# EAGLE design solar-pmic (EAGLE 7.1.0)
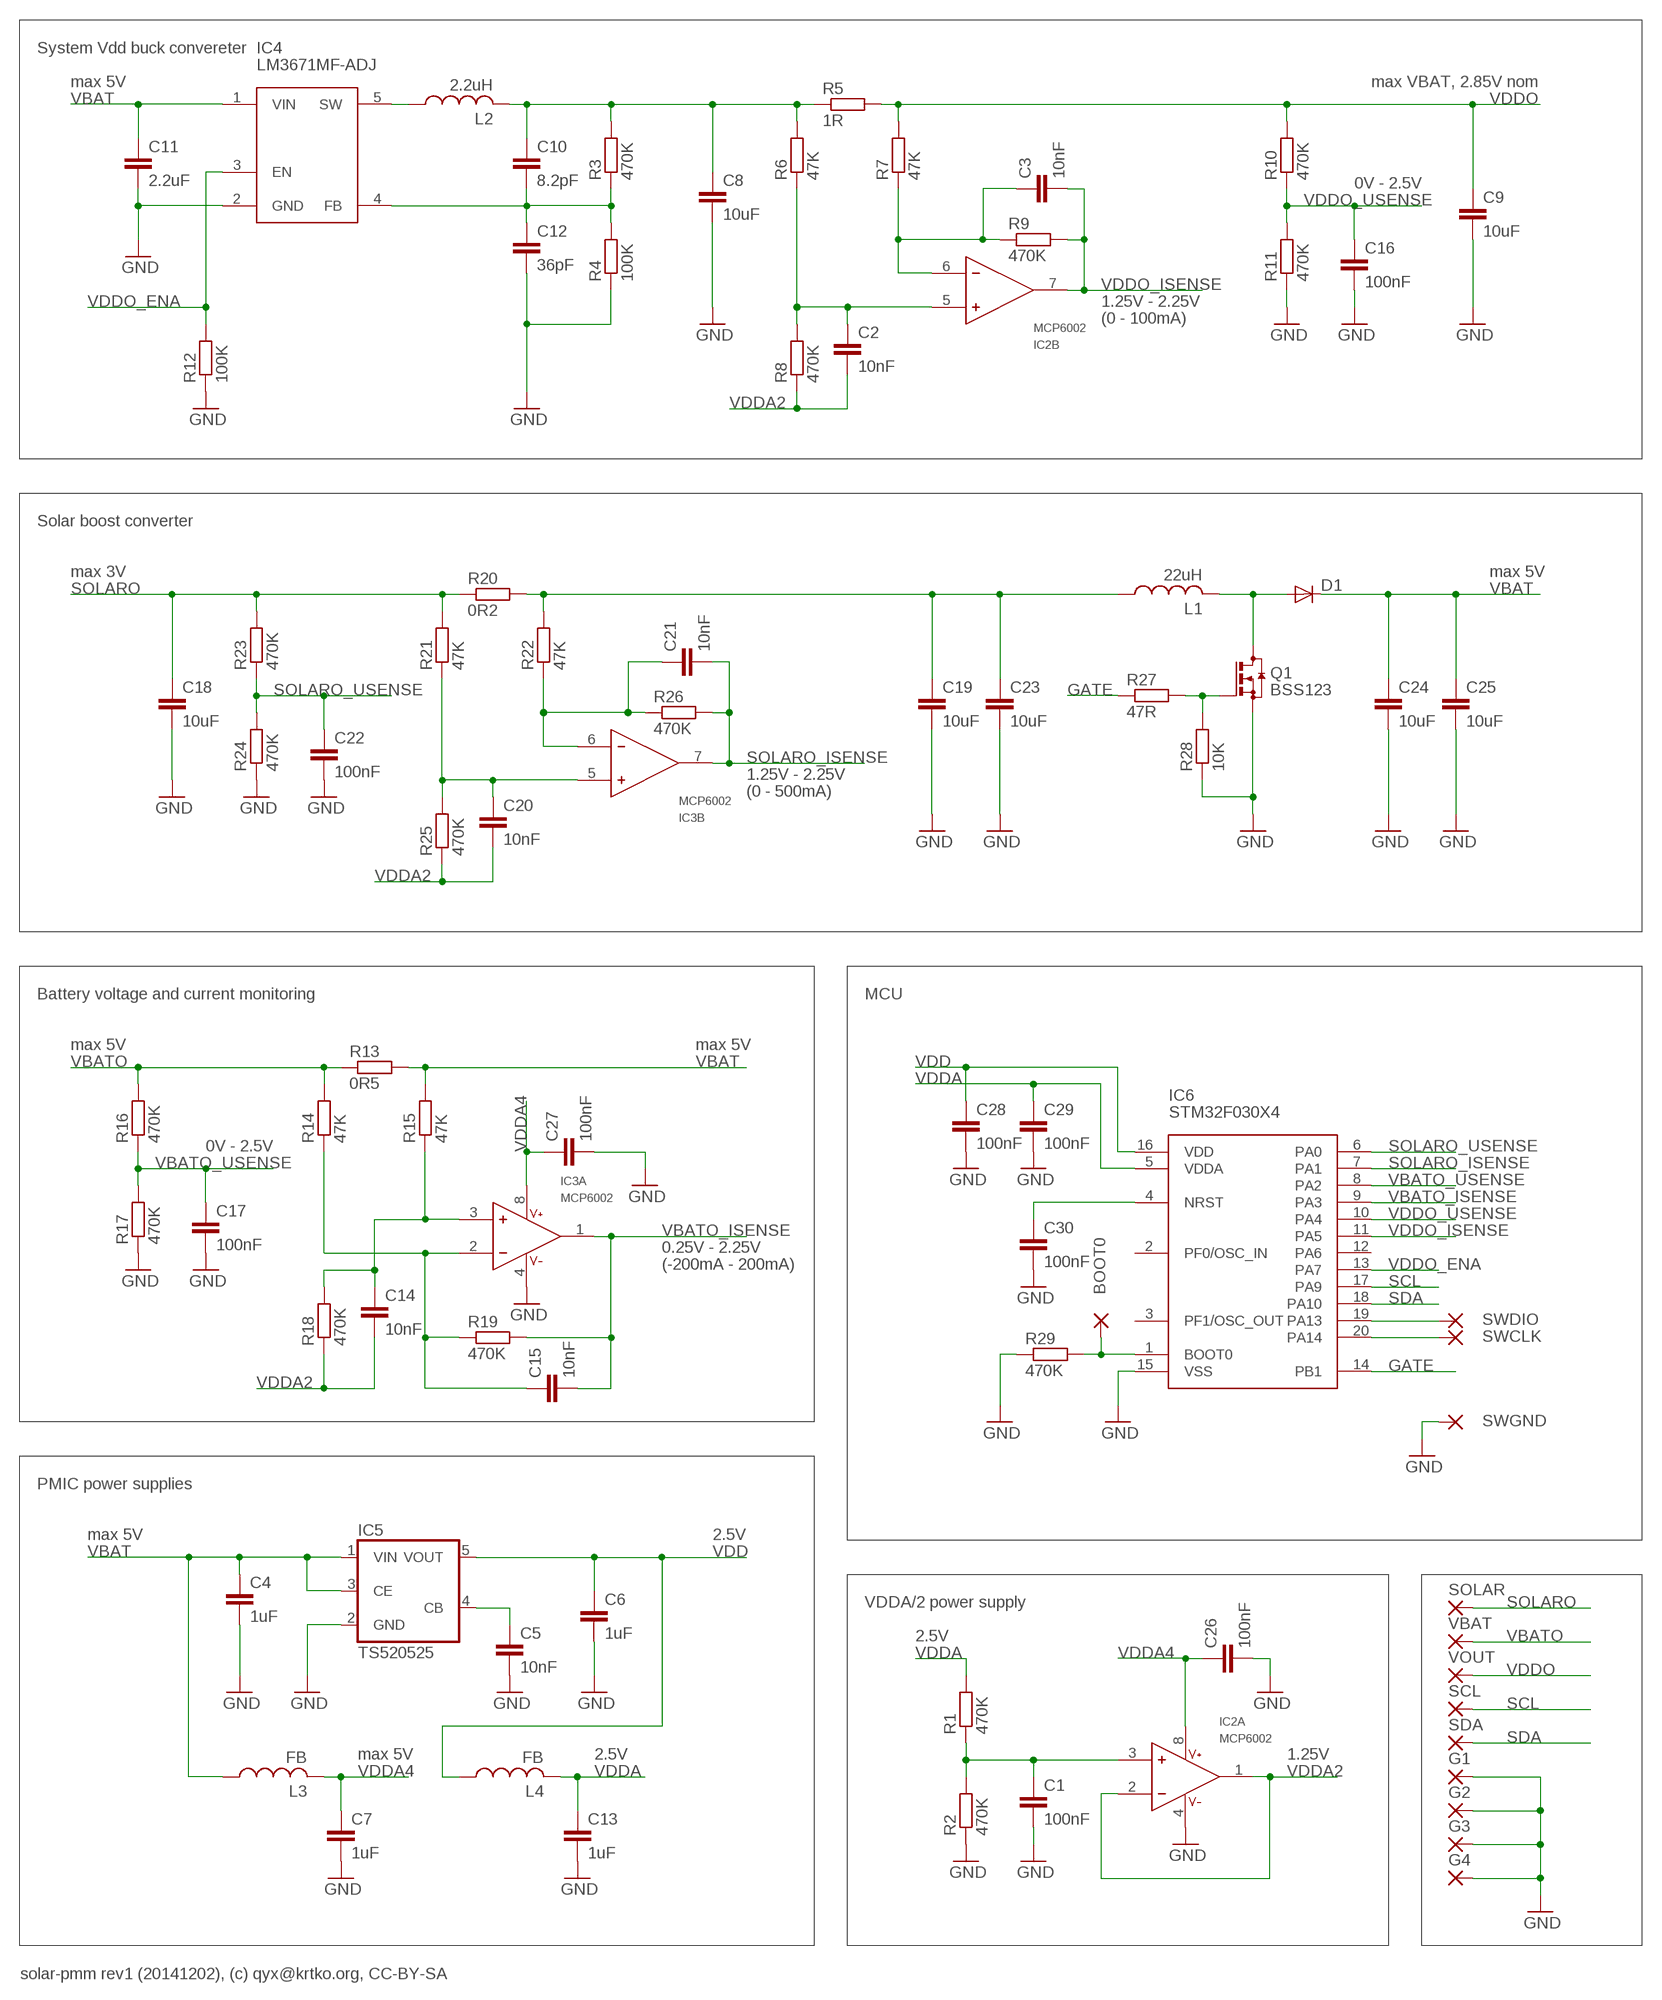
[diagram p0: schematic, sheet 1]

## Parts
BOOT0  SMD2  [SMD1,27-2,54]
C1  100nF  C-EUC0603  [C0603]
C2  10nF  C-EUC0603  [C0603]
C3  10nF  C-EUC0603  [C0603]
C4  1uF  C-EUC0603  [C0603]
C5  10nF  C-EUC0603  [C0603]
C6  1uF  C-EUC0603  [C0603]
C7  1uF  C-EUC0603  [C0603]
C8  10uF  C-EUC0805  [C0805]
C9  10uF  C-EUC0805  [C0805]
C10  8.2pF  C-EUC0603  [C0603]
C11  2.2uF  C-EUC0805  [C0805]
C12  36pF  C-EUC0603  [C0603]
C13  1uF  C-EUC0603  [C0603]
C14  10nF  C-EUC0603  [C0603]
C15  10nF  C-EUC0603  [C0603]
C16  100nF  C-EUC0603  [C0603]
C17  100nF  C-EUC0603  [C0603]
C18  10uF  C-EUC0805  [C0805]
C19  10uF  C-EUC0805  [C0805]
C20  10nF  C-EUC0603  [C0603]
C21  10nF  C-EUC0603  [C0603]
C22  100nF  C-EUC0603  [C0603]
C23  10uF  C-EUC0805  [C0805]
C24  10uF  C-EUC0805  [C0805]
C25  10uF  C-EUC0805  [C0805]
C26  100nF  C-EUC0603  [C0603]
C27  100nF  C-EUC0603  [C0603]
C28  100nF  C-EUC0603  [C0603]
C29  100nF  C-EUC0603  [C0603]
C30  100nF  C-EUC0603  [C0603]
D1  DIODE-MINIMELF  [MINIMELF]
G1  2,15/1,0  [2,15/1,0]
G2  2,15/1,0  [2,15/1,0]
G3  2,15/1,0  [2,15/1,0]
G4  2,15/1,0  [2,15/1,0]
IC2  MCP6002  LT6237CMS8  [MSOP8]
IC3  MCP6002  LT6237CMS8  [MSOP8]
IC4  LM3671MF-ADJ  LM3671MF  [SOT23-5]
IC5  TS520525  [SOT25]
IC6  STM32F030X4  [TSSOP20_SO]
L1  22uH  L-USL3225M  [L3225M]
L2  2.2uH  L-USL3225M  [L3225M]
L3  FB  L-USL2012C  [L2012C]
L4  FB  L-USL2012C  [L2012C]
Q1  BSS123  [SOT23]
R1  470K  R-EU_R0603  [R0603]
R2  470K  R-EU_R0603  [R0603]
R3  470K  R-EU_R0603  [R0603]
R4  100K  R-EU_R0603  [R0603]
R5  1R  R-EU_R0805  [R0805]
R6  47K  R-EU_R0603  [R0603]
R7  47K  R-EU_R0603  [R0603]
R8  470K  R-EU_R0603  [R0603]
R9  470K  R-EU_R0603  [R0603]
R10  470K  R-EU_R0603  [R0603]
R11  470K  R-EU_R0603  [R0603]
R12  100K  R-EU_R0603  [R0603]
R13  0R5  R-EU_R0805  [R0805]
R14  47K  R-EU_R0603  [R0603]
R15  47K  R-EU_R0603  [R0603]
R16  470K  R-EU_R0603  [R0603]
R17  470K  R-EU_R0603  [R0603]
R18  470K  R-EU_R0603  [R0603]
R19  470K  R-EU_R0603  [R0603]
R20  0R2  R-EU_R0805  [R0805]
R21  47K  R-EU_R0603  [R0603]
R22  47K  R-EU_R0603  [R0603]
R23  470K  R-EU_R0603  [R0603]
R24  470K  R-EU_R0603  [R0603]
R25  470K  R-EU_R0603  [R0603]
R26  470K  R-EU_R0603  [R0603]
R27  47R  R-EU_R0603  [R0603]
R28  10K  R-EU_R0603  [R0603]
R29  470K  R-EU_R0603  [R0603]
SCL  2,15/1,0  [2,15/1,0]
SDA  2,15/1,0  [2,15/1,0]
SOLAR  2,15/1,0  [2,15/1,0]
SWCLK  SMD2  [SMD1,27-2,54]
SWDIO  SMD2  [SMD1,27-2,54]
SWGND  SMD2  [SMD1,27-2,54]
VBAT  2,15/1,0  [2,15/1,0]
VOUT  2,15/1,0  [2,15/1,0]

## Nets
GATE: IC6.14(PB1) R27.1
GND: C1.2 C4.2 C5.2 C6.2 C7.2 C8.2 C9.2 C11.2 C12.2 C13.2 C16.2 C17.2 C18.2 C19.2 C22.2 C23.2 C24.2 C25.2 C26.2 C27.2 C28.2 C29.2 C30.2 G1.1(P) G2.1(P) G3.1(P) G4.1(P) IC2.4(A:V-) IC3.4(A:V-) IC4.2(GND) IC5.2(GND) IC6.15(VSS) Q1.2(S) R2.1 R4.1 R11.1 R12.1 R17.1 R24.1 R28.1 R29.1 SWGND.1(P)
N$1: C1.1 IC2.3(A:IN+) R1.1 R2.2
N$2: C8.1 C10.1 L2.2 R3.2 R5.1 R6.2
N$3: IC4.5(SW) L2.1
N$4: Q1.1(G) R27.2 R28.2
N$5: C3.1 IC2.6(B:IN-) R7.1 R9.1
N$6: C2.1 IC2.5(B:IN+) R6.1 R8.2
N$7: C10.2 C12.1 IC4.4(FB) R3.1 R4.2
N$8: C21.1 IC3.6(B:IN-) R22.1 R26.1
N$9: C5.1 IC5.4(CB)
N$10: C20.1 IC3.5(B:IN+) R21.1 R25.2
N$11: C15.1 IC3.2(A:IN-) R14.1 R19.1
N$12: C19.1 C23.1 L1.1 R20.2 R22.2
N$13: D1.A L1.2 Q1.3(D)
N$14: C14.1 IC3.3(A:IN+) R15.1 R18.2
N$15: BOOT0.1(P) IC6.1(BOOT0) R29.2
N$16: IC6.19(PA13) SWDIO.1(P)
N$17: IC6.20(PA14) SWCLK.1(P)
N$18: C30.1 IC6.4(NRST)
SCL: IC6.17(PA9) SCL.1(P)
SDA: IC6.18(PA10) SDA.1(P)
SOLARO: C18.1 R20.1 R21.2 R23.2 SOLAR.1(P)
SOLARO_ISENSE: C21.2 IC3.7(B:OUT) IC6.7(PA1) R26.2
SOLARO_USENSE: C22.1 IC6.6(PA0) R23.1 R24.2
VBAT: C4.1 C11.1 C24.1 C25.1 D1.C IC4.1(VIN) IC5.1(VIN) IC5.3(CE) L3.1 R13.2 R15.2
VBATO: R13.1 R14.2 R16.2 VBAT.1(P)
VBATO_ISENSE: C15.2 IC3.1(A:OUT) IC6.9(PA3) R19.2
VBATO_USENSE: C17.1 IC6.8(PA2) R16.1 R17.2
VDD: C6.1 C28.1 IC5.5(VOUT) IC6.16(VDD) L4.1
VDDA: C13.1 C29.1 IC6.5(VDDA) L4.2 R1.2
VDDA2: C2.2 C14.2 C20.2 IC2.1(A:OUT) IC2.2(A:IN-) R8.1 R18.1 R25.1
VDDA4: C7.1 C26.1 C27.1 IC2.8(A:V+) IC3.8(A:V+) L3.2
VDDO: C9.1 R5.2 R7.2 R10.2 VOUT.1(P)
VDDO_ENA: IC4.3(EN) IC6.13(PA7) R12.2
VDDO_ISENSE: C3.2 IC2.7(B:OUT) IC6.11(PA5) R9.2
VDDO_USENSE: C16.1 IC6.10(PA4) R10.1 R11.2
Unconnected: IC6.2(PF0/OSC_IN) IC6.3(PF1/OSC_OUT) IC6.12(PA6)

## Notes on the sheet
- System Vdd buck convereter
- max 5V | max VBAT, 2.85V nom
- 0V - 2.5V
- 1.25V - 2.25V
- (0 - 100mA)
- Solar boost converter
- max 3V | max 5V
- 1.25V - 2.25V
- (0 - 500mA)
- Battery voltage and current monitoring | MCU
- max 5V | max 5V
- 0V - 2.5V
- 0.25V - 2.25V
- (-200mA - 200mA)
- PMIC power supplies
- max 5V | 2.5V
- VDDA/2 power supply
- 2.5V
- max 5V | 2.5V | 1.25V
- solar-pmm rev1 (20141202), (c) qyx@krtko.org, CC-BY-SA

## Library data of the parts
BOOT0 SWCLK SWDIO SWGND = wirepad:SMD2: SMD PAD
C1-C30 = rcl:C-EU: CAPACITOR, European symbol
D1 = diode:DIODE-: DIODE
G1-G4 SCL SDA SOLAR VBAT VOUT = wirepad:2,15/1,0: THROUGH-HOLE PAD
IC2 IC3 = qyx-misc:LT6237
IC4 = qyx-misc:LM3671
IC5 = v-reg:TS5205: 150mA Low Noise LDO Voltage Regulator with Enable TSC [Taiwan Semiconductor Company, Ltd] Source: http://www.taiwansemi.com .. 5205_0409c.pdf
IC6 = qyx-misc:STM32F030X4
L1-L4 = rcl:L-US: INDUCTOR, American symbol
Q1 = transistor-small-signal:BSS123: N-CHANNEL MOS FET
R1-R29 = rcl:R-EU_: RESISTOR, European symbol

## Board
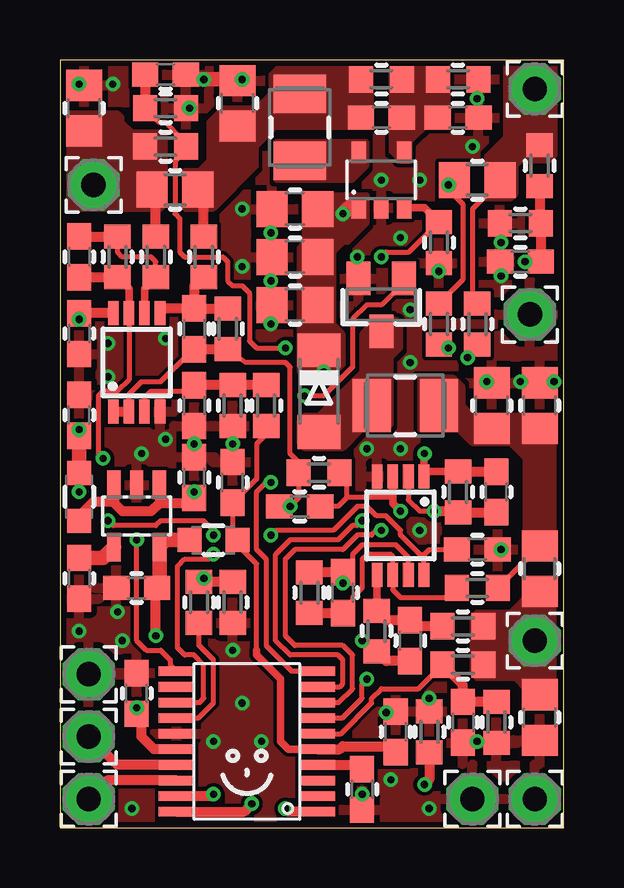
[diagram p1: board, top side]
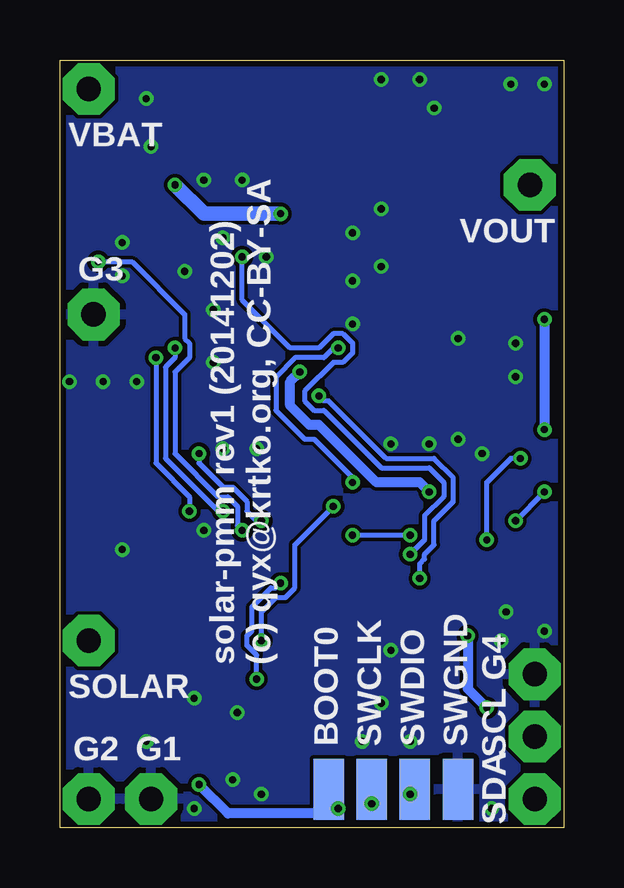
[diagram p2: board, bottom side, seen from below]

Size 21 x 32 mm. Coordinates in mm from the lower left corner, seen from the top.
Outline: 0,0 21,0 21,32 0,32 0,0
Copper layers (1*16): Top 0.035mm / dielectric 1.5mm / Bottom 0.035mm
Design rules "seeed": minimum track width 6mil, minimum drill 0.3mm, track to track 6mil, track to pad 6mil, pad to pad 6mil, via to via 6mil, smd to smd 0mil, copper to edge 10mil, drill to drill 10mil, minimum pad ring 6mil, minimum via ring 6mil, stop-mask expansion 2mil, vias tented up to drill 0.5mm, thermal gap 10mil

### Footprints (pad centres in the part's own frame; a part is rotated, then mirrored left to right if it is on the bottom)
SMD1,27-2,54 = smd 1.27 x 2.54: 1 0,0
C0603 = smd 1.1 x 1: 1 -0.85,0; 2 0.85,0
C0805 = smd 1.3 x 1.5: 1 -0.95,0; 2 0.95,0
MINIMELF = smd 1.4 x 1.8: A 1.7,0; C -1.7,0
2,15/1,0 = drill 1.016 pad 2.159 octagon: 1 0,0
MSOP8 = smd 0.45 x 1: 1 -0.975,-2.05; 2 -0.325,-2.05; 3 0.325,-2.05; 4 0.975,-2.05; 5 0.975,2.05; 6 0.325,2.05; 7 -0.325,2.05; 8 -0.975,2.05
SOT23-5 = smd 0.6 x 0.9: 1 -0.95,-1.15; 2 0,-1.15; 3 0.95,-1.15; 4 0.95,1.15; 5 -0.95,1.15
SOT25 = smd 0.55 x 1.2: 1 -0.95,-1.3; 2 0,-1.3; 3 0.95,-1.3; 4 0.95,1.3; 5 -0.95,1.3
TSSOP20_SO = smd 0.4 x 1.5: 1 -2.925,-2.925; 2 -2.275,-2.925; 3 -1.625,-2.925; 4 -0.975,-2.925; 5 -0.325,-2.925; 6 0.325,-2.925; 7 0.975,-2.925; 8 1.625,-2.925; 9 2.275,-2.925; 10 2.925,-2.925; 11 2.925,2.925; 12 2.275,2.925; 13 1.625,2.925; 14 0.975,2.925; 15 0.325,2.925; 16 -0.325,2.925; 17 -0.975,2.925; 18 -1.625,2.925; 19 -2.275,2.925; 20 -2.925,2.925
L3225M = smd 1.6 x 2.2: 1 -1.4,0; 2 1.4,0
L2012C = smd 1 x 1: 1 -1,0; 2 1,0
SOT23 = smd 1 x 1.4: 1 -0.95,-1.1; 2 0.95,-1.1; 3 0,1.1
R0603 = smd 1 x 1.1: 1 -0.85,0; 2 0.85,0
R0805 = smd 1.3 x 1.5: 1 -0.95,0; 2 0.95,0

### Placement (x,y rotation side)
BOOT0  9.8,1.6 0 bottom
C1  5.6,17.6 270 top
C2  5.6,20.8 270 top
C3  0.8,23.8 270 top
C4  5.6,14.6 90 top
C5  0.8,10.4 270 top
C6  3.2,10 180 top
C7  0.8,17.2 90 top
C8  7.4,30.2 90 top
C9  1,30 90 top
C10  13.4,29.6 0 top
C11  9.8,25.8 180 top
C12  16.6,29.6 0 top
C13  7.2,14.4 90 top
C14  10,13.4 180 top
C15  18.2,14 90 top
C16  4.4,31.4 0 top
C17  19.2,23.6 180 top
C18  20,4.6 270 top
C19  20,17.6 90 top
C20  14.6,7.8 270 top
C21  11.8,9.8 90 top
C22  16.8,4.4 270 top
C23  18,17.6 90 top
C24  9.8,21.8 180 top
C25  9.8,23.8 180 top
C26  0.8,20.6 270 top
C27  17.4,11.6 0 top
C28  3.2,5.6 90 top
C29  14,4 90 top
C30  12.6,1.6 270 top
D1  10.8,18.2 270 top
G1  17.2,1.2 0 top
G2  19.8,1.2 0 top
G3  19.6,21.4 0 top
G4  1.2,6.4 0 top
IC2  3.2,19.4 0 top
IC3  14.2,12.6 180 top
IC4  13.4,27 0 top
IC5  3.2,13 180 top
IC6  7.8,3.6 90 top
L1  14.4,17.6 180 top
L2  10,29.2 90 top
L3  0.8,13.8 90 top
L4  6.4,12 0 top
Q1  13.4,21.8 180 top
R1  8.6,17.6 270 top
R2  7.2,17.6 90 top
R3  13.4,31.2 180 top
R4  16.6,31.2 180 top
R5  4.8,26.6 180 top
R6  6,23.8 90 top
R7  4,23.8 90 top
R8  7,20.8 90 top
R9  2.4,23.8 270 top
R10  4.4,28.4 180 top
R11  4.4,30 180 top
R12  15.8,24.4 90 top
R13  17.4,27 180 top
R14  17.4,21 90 top
R15  15.8,21 90 top
R16  20,27.6 90 top
R17  19.2,25.2 0 top
R18  10.8,14.8 0 top
R19  16.6,14 90 top
R20  20,10.8 90 top
R21  16.8,8.4 0 top
R22  17.4,10 0 top
R23  16.8,6.8 0 top
R24  18.2,4.4 90 top
R25  13.2,8.2 90 top
R26  10.4,9.8 90 top
R27  5.8,9.4 90 top
R28  7.2,9.4 90 top
R29  15.4,4 270 top
SCL  1.2,3.8 0 top
SDA  1.2,1.2 0 top
SOLAR  19.8,7.8 0 top
SWCLK  8,1.6 0 bottom
SWDIO  6.2,1.6 0 bottom
SWGND  4.4,1.6 0 bottom
VBAT  19.8,30.8 0 top
VOUT  1.4,26.8 0 top

### Tracks (layer width: path | path; a pad name or v marks a point on that pad's centre or on a via)
GATE
  Top 0.2: IC6.14 5.78,4.58 6.4,5.2 6.4,7 5.8,7.6 R27.1
GND  (via drill 0.3)
  Top 0.406: v17.4,3.6 16.85,3.6 C22.2 | v18.4,23 18.4,23.55 C17.2
  Top 0.61: 7.4,31.2 v6,31.2 5.4,31.2 5.2,31.4
  other vias: 7.6,5.2 7.6,25.8 7.6,23.4 8.8,24.8 13.4,27 12.4,23.8 15,27 2,20.2 4.4,16.2 7.2,16 3.4,15.6 5.6,16 17.4,30.4 17.2,28.4 14.2,24.6 15.8,23.2 14.6,21.6 7.6,31.2 5.4,30 2.2,31 0.8,31 18.4,24.4 17.8,18.6 19.2,18.6 20.6,18.6 18.4,11.6 8.8,22.8 8.8,21 15,12.4 12.8,15.8 12.6,1.4 3,0.8 6.4,3.6 13.6,4.8 15.4,5.4 8.4,3.6 7.2,7.4 0.8,8.2 2.6,7.8 2.4,9 4.4,20.4 2,18.8 14.2,15.8 14.6,19.4 13.8,2 15.4,0.8
  pour Bottom (rank 2): 0.2,0.2 20.8,0.2 20.8,31.8 0.2,31.8
  pour Top (rank 2): 0.2,0.2 20.8,0.2 20.8,31.8 0.2,31.8
N$1
  Top 0.2: IC2.3 3.53,17.93 3.8,18.2 5.35,18.2 C1.1
  Top 0.406: R1.1 R2.2 C1.1
N$2
  Top 0.406: R6.2 6,26.35 R5.1
  pour Top (no thermals): 9,29.2 13,29.2 13,31.8 9.2,31.8 8.8,31.4 8.8,30.6 8.2,30 6.8,30 6.2,29.4 6.2,27.8 5.8,27.4 5.2,27.4 5.2,25.8 6.4,25.8 8.2,27.6 8.2,28.4
N$3
  pour Top (no thermals): 9,27 12.2,27 12.8,27.6 12.8,28.6 9,28.6
N$4  (via drill 0.3)
  Top 0.2: Q1.1 14.35,22.75 13.4,21.8 12.8,21.8 12.2,21.2 12.2,19.2 11,18 v10.2,18
  Top 0.406: R28.2 R27.2 v6,10.4
  Bottom 0.2: v10.2,18 10,17.8 9.8,17.8 7.4,15.4 5.4,15.4 4.6,14.6 4.6,13.6 5.4,12.8 5.4,11.8 5.8,11.4 5.8,11.2 6,11 v6,10.4
N$5
  Top 0.2: R7.1 4,23.6 3.8,23.8 2.6,23.8 2.4,24 R9.1
  Top 0.305: IC2.6 3.53,22.48 R7.1
  Top 0.406: C3.1 R9.1
N$6
  Top 0.406: C2.1 4.37,21.65 IC2.5 | C2.1 R8.2 | R6.1 5.95,22.95 5.6,22.6 C2.1
N$7
  pour Top (no thermals): 14.2,27.8 14.6,27.8 14.6,28.6 15.4,29.4 16.2,29.4 16.2,31.8 13.8,31.8 13.8,28.2
N$8
  Top 0.2: R22.1 16.15,9.6 14.2,9.6 13.87,9.93 IC3.6 13.87,11.32 13.8,11.4 12.8,11.4 12.6,11.2 12.6,10 12.2,9.6 12.2,9.35 C21.1
  Top 0.406: R26.1 C21.1
N$9
  Top 0.61: C5.1 1.8,11.25 IC5.4
N$10
  Top 0.2: 13.22,9.27 R25.2
  Top 0.305: IC3.5 13.22,9.27
  Top 0.406: R25.2 13.6,8.65 C20.1 14.85,8.4 R21.1
N$11  (via drill 0.3)
  Top 0.2: IC3.2 14.53,13.68 15,13.2 v15.6,13.2 | R14.1 17.4,20 v17,19.6
  Top 0.406: v15.6,13.2 16.55,13.2 R19.1 C15.1
  Bottom 0.2: v17,19.6 17,15.2 15.6,13.8 v15.6,13.2
N$12
  Top 0.2: R20.2 R22.2
  pour Top (no thermals): 15,18.8 16.4,18.8 16.8,18.4 16.8,17.6 17.2,17.2 20.6,17.2 20.6,11.2 19.4,11.2 19.4,15.4 18.8,16 17.2,16 16.6,16.6 15,16.6
N$13
  pour Top (no thermals): 13.2,21.2 14,21.2 14.2,21 14.2,20 13.8,19.6 13.8,16.8 13.6,16.6 12.6,16.6 11.8,15.8 10.2,15.8 10,16 10,17 10.2,17.2 10.8,17.2 12.6,19 12.6,20.6
N$14  (via drill 0.3)
  Top 0.2: R15.1 16.05,20.15 v16.2,20 | 13.87,13.78 11.98,13.78 | 11.98,13.78 11.6,13.4 C14.1 | 11.98,13.78 11.98,14.47 R18.2
  Top 0.305: IC3.3 13.87,13.78 13.87,13.53 v14.2,13.2
  Bottom 0.2: v16.2,20 16.2,19.6 16.6,19.2 16.6,15.4 14.4,13.2 v14.2,13.2
N$15  (via drill 0.3)
  Top 0.406: R29.2 15.4,2 v15.2,1.8 | IC6.1 9.53,0.67 v9.4,0.8
  Bottom 0.406: BOOT0.1 9.8,1.2 v9.4,0.8 9.6,0.6 14,0.6 v15.2,1.8
N$16  (via drill 0.3)
  Top 0.406: IC6.19 6.33,1.33 v6.4,1.4
  Bottom 0.406: v6.4,1.4 SWDIO.1
N$17  (via drill 0.3)
  Top 0.406: IC6.20 7.67,0.67 v8,1
  Bottom 0.406: v8,1 SWCLK.1
N$18
  Top 0.2: 12.22,2.62 C30.1
  Top 0.406: IC6.4 12.22,2.62
SCL
  Top 0.406: IC6.17 2.38,2.62 SCL.1
SDA
  Top 0.406: IC6.18 1.97,1.97 SDA.1
SOLARO
  pour Top (no thermals): 19.4,10.4 20.6,10.4 20.6,5 19.4,5 19.4,5.8 19,6.2 17.4,6.2 17.2,6.4 17.2,8.8 17.4,9 18.8,9 19.4,9.6
SOLARO_ISENSE  (via drill 0.3)
  Top 0.2: IC3.7 14.53,11.28 14,11.8 12.6,11.8 12.2,11.4 12.2,11.05 C21.2 v11.8,10.2 | v12.8,6.2 12.6,6 12.6,5.4 11.78,4.58 IC6.7
  Top 0.406: C21.2 R26.2
  Bottom 0.2: v12.8,6.2 12.8,7.2 13.2,7.6 13.2,8 13,8.2 13,9.2 12.2,10 12,10 v11.8,10.2
SOLARO_USENSE
  Top 0.2: R23.1 14.95,5.8 13.4,5.8 13,5.4 13,5.2 11.72,3.92 IC6.6
  Top 0.406: R23.1 16.8,5.95 C22.1 R24.2
VBAT  (via drill 0.3)
  Top 0.2: R13.2 16.45,26.35 16.8,26 16.8,22.85 R15.2
  Top 0.406: IC5.1 4.15,13.55 | 4.15,13.55 3.8,13.2 2.6,13.2 2.25,13.55 | IC5.3 2.25,13.55 | L3.1 0.8,13 1.4,13.6 2.2,13.6 2.25,13.55 | 4.15,13.55 5.4,13.55 C4.1
  Top 0.61: IC4.1 12.05,25.85 v11.8,25.6 | v16.2,26.8 16.25,26.8 R13.2 | C4.1 v5.6,14
  Bottom 0.406: v5.6,14 6,14.4 7.8,14.4 10.2,16.8 10.6,16.8 11.4,17.6 11.4,18.6 v11,19
  Bottom 0.61: v11.8,25.6 15,25.6 v16.2,26.8
  pour Top (no thermals): 10.2,26.4 12.8,26.4 12.8,25.2 12,24.4 11.8,24.4 11.4,24 11.4,21 11.8,20.6 11.8,19 11.4,18.6 10.4,18.6 10,19 10,24.2 10.2,24.4 10.4,24.4 10.2,24.6
VBATO
  Top 0.2: R13.1 18.35,26.95 17.2,25.8 17.2,22.05 R14.2
  pour Top (no thermals): 18.6,31.8 20.8,31.8 20.8,28.2 20.4,27.8 19.2,27.8 19,27.6 19,26.4 18.8,26.2 17.8,26.2 17.8,28 18.6,28.8
VBATO_ISENSE  (via drill 0.3)
  Top 0.2: IC6.9 11.67,5.87 11.8,6 11.8,7 11.6,7.2 9.6,7.2 9,7.8 9,11.4 9.6,12 11.6,12 12.2,12.6 12.4,12.6 v12.6,12.8
  Top 0.305: v15.2,15.6 15.17,15.57 IC3.1 15.37,14.85 R19.2
  Top 0.406: R19.2 C15.2
  Bottom 0.2: v15.2,15.6 15.2,15.2 14.2,14.2 13.8,14.2 13.2,13.6 13.2,13.2 12.8,12.8 v12.6,12.8
VBATO_USENSE  (via drill 0.3)
  Top 0.2: C17.1 v19.4,23.6 | IC6.8 11.62,5.23 12.2,5.8 12.2,7.2 11.8,7.6 9.8,7.6 9.4,8 9.4,11.2 9.8,11.6 11.8,11.6 12.4,12.2 13,12.2 13.2,12.4 v13.4,12.4
  Top 0.406: R16.1 20,25.25 | R17.2 C17.1
  Top 0.61: 20,25.25 R17.2
  Bottom 0.2: v19.4,23.6 18,23.6 15.8,21.4 15.8,20.4 15.6,20.2 15.6,19.6 16.2,19 16.2,15.6 14.4,13.8 14,13.8 13.6,13.4 13.6,12.6 v13.4,12.4
VDD  (via drill 0.3)
  Top 0.406: IC6.16 3.92,3.27 3.4,3.8 3.4,4.55 C28.1 v3.2,5 | v4,8 4,9.95 C6.1
  Top 0.61: C6.1 4.15,10.1 IC5.5 4.15,11.75 4.4,12 L4.1
  Bottom 0.406: v4,8 4,5.8 v3.2,5
VDDA
  Top 0.2: R1.2 8.8,16.6 8.2,16 8.2,14.55 C13.1 7.2,12.2 L4.2 7.4,11.8 8.2,11 8.2,7.4 | 13.55,3.4 C29.1
  Top 0.305: IC6.5 9.53,3.27 9.2,3.6 9.2,6.2 8.2,7.2 8.2,7.4
  Top 0.406: IC6.5 11.67,3.27 11.8,3.4 13.55,3.4
VDDA2  (via drill 0.3)
  Top 0.2: IC2.2 2.88,18.07 3.4,18.6 4.2,18.6 5.4,19.8 5.45,19.8 C2.2 | R8.1 7.75,19.4 9.4,19.4 9.6,19.2 9.6,15.6 9.95,15.25 R18.1 9.95,13.75 v9.6,13.4 C14.2 | R25.1 13.05,7.35 v12.6,7.8
  Top 0.406: C2.2 R8.1 | IC2.1 IC2.2 | C20.2 13.6,6.95 R25.1
  Bottom 0.2: v12.6,7.8 12.6,9 12,9.6 11.6,9.6 11.2,10 11.2,11.8 v9.6,13.4
VDDA4  (via drill 0.3)
  Top 0.2: IC3.8 15.17,11.38 | 15.17,11.38 15.4,11.6 C27.1 | 15.17,11.38 15.03,11.38 14.2,12.2 14.2,12.4 13.6,13 13.2,13 12.8,13.4 12.4,13.4 11.4,12.4 9,12.4 v8.8,12.2 | v0.8,14 L3.2 | v2,12.8 2.2,12.6 4,12.6 4.2,12.8 6,12.8 6.4,12.4 v6.4,12.2
  Top 0.406: IC2.8 C26.1 v0.8,21.2 | v0.8,16.6 C7.1
  Top 0.61: C7.1 L3.2
  Bottom 0.2: v8.8,12.2 v6.4,12.2 | v2,12.8 v0.8,14
  Bottom 0.406: v0.8,21.2 v0.8,16.6
VDDO
  Top 0.406: R7.2 4,26.45 R5.2
  pour Top (no thermals): 0.2,25.8 4.2,25.8 4.4,26 4.4,28.8 4.2,29 3,29 2.6,29.4 2.6,29.6 2.4,29.8 0.2,29.8
VDDO_ENA  (via drill 0.3)
  Top 0.2: IC6.13 5.83,5.23 6,5.4 6,6.8 5.6,7.2 5.2,7.2 4.9,7.5 4.9,10.9 5.2,11.2 6.2,11.2 v6.4,11.4 | v13.4,23.8 13.6,24 14.55,24 R12.2
  Top 0.305: IC4.3 15.2,25.85 R12.2
  Bottom 0.2: v13.4,23.8 13.4,22 11.4,20 10.2,20 9.6,20.6 9.2,20.6 8.8,20.2 8.8,19.8 9.2,19.4 9.6,19.4 10.8,18.2 10.8,17.8 10.4,17.4 10,17.4 7.6,15 5.6,15 5,14.4 5,13.8 5.8,13 5.8,12 v6.4,11.4
VDDO_ISENSE  (via drill 0.3)
  Top 0.2: IC2.7 2.88,18.68 2.4,18.2 1.8,18.2 1.6,18 1.6,15.6 v1.8,15.4 | v3.2,12 3.2,7.8 3.6,7.4 4.2,7.4 4.6,7 4.6,6.8 IC6.11
  Top 0.305: IC2.7 2.88,22.48 R9.2
  Top 0.406: C3.2 R9.2
  Bottom 0.2: v1.8,15.4 2.2,15.4 3.2,14.4 v3.2,12
VDDO_USENSE  (via drill 0.3)
  Top 0.2: IC6.10 9.67,6.52 8.6,7.6 8.6,11.2 8.2,11.6 8.2,14 8.6,14.4 v8.8,14.4 | v9.4,20 8.2,20 7.9,20.3 7.9,22.3 7.6,22.6 7.2,22.6 7,22.8 7,23.6 6.8,23.8 5.2,23.8 5,24 5,25.4 4.8,25.6 4.8,27.8 5.25,28.25 R10.1 5,28.65 5,28.8 4.4,29.4 4.15,29.4 R11.2
  Top 0.406: C16.1 R11.2
  Bottom 0.2: v9.4,20 9.6,20 10,19.6 11.2,19.6 12,18.8 12,17.4 10.8,16.2 10.4,16.2 8.8,14.6 v8.8,14.4

### Text on the board
bNames: solar-pmm rev1 (20141202) / (c) qyx@krtko.org, CC-BY-SA
fence_solar_charger: solar / charger
fence_vout_supply: vout power / supply
fence_sensing: current & voltage / sensing
fence_mcu_vreg: MCU / + vreg